# Altium schematic sheet 09_LMS2_RF.SchDoc: LMS7002M RF (LMS2)
size A3; Organization: Lime Microsystems; Address1: Surrey Tech Centre; Address2: Guildford GU2 7YG; Address3: Surrey; Address4: United Kingdom; Revision: v1.1; SheetNumber: 9; SheetTotal: 31
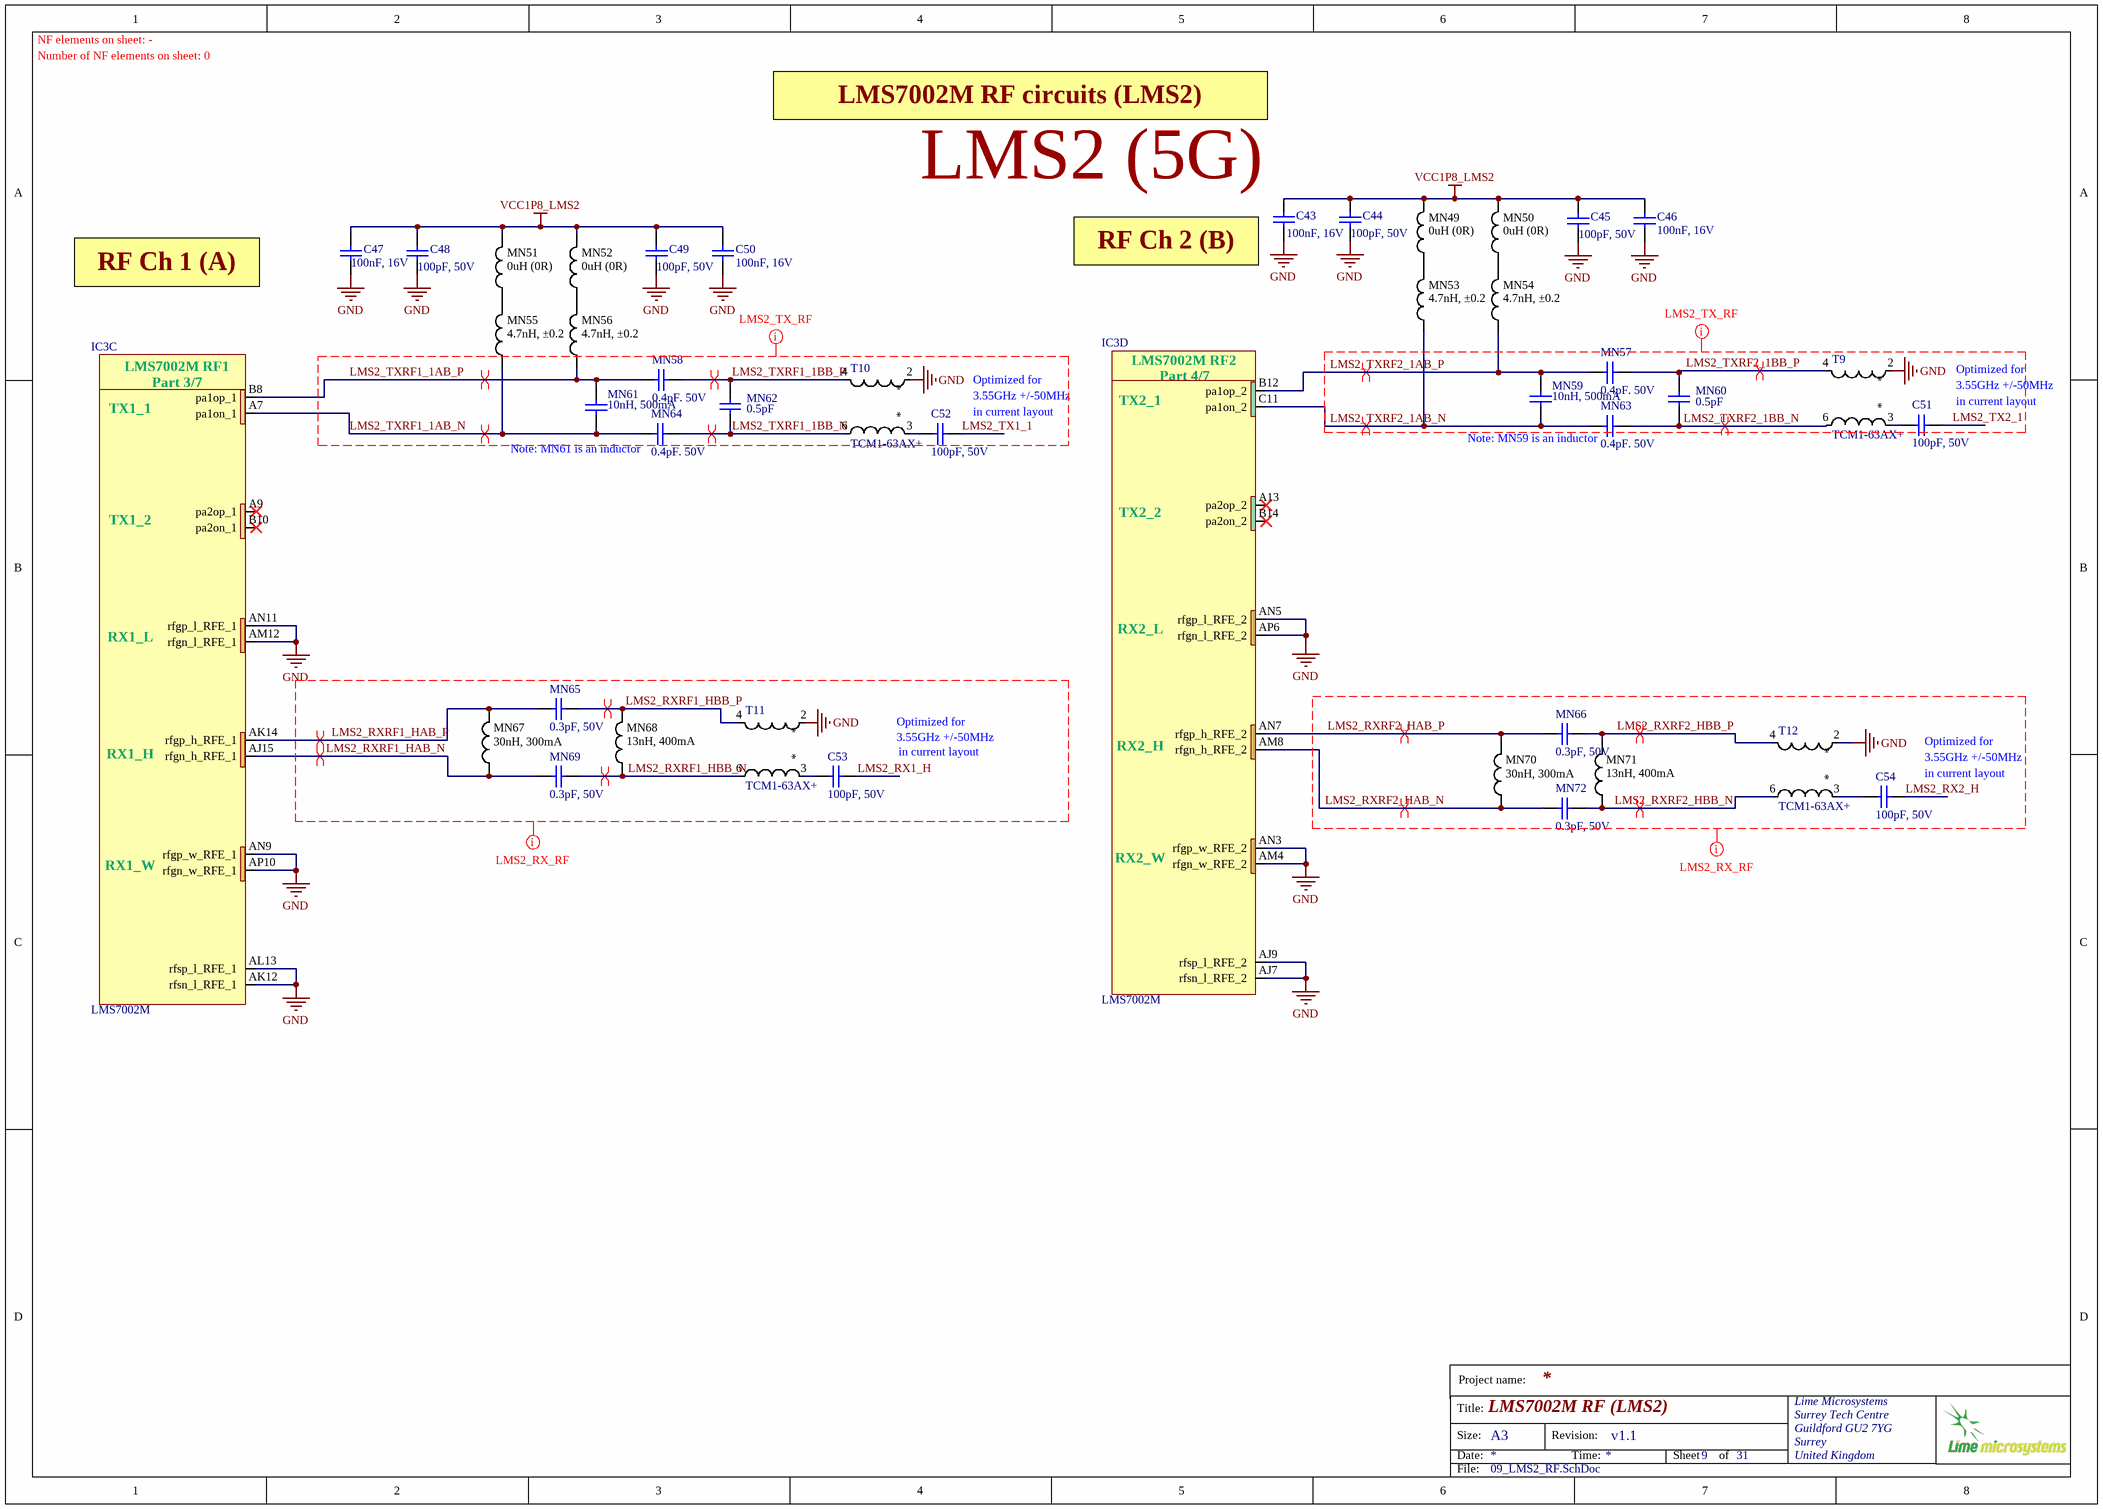
[diagram p0: 09_LMS2_RF.SchDoc]

## Parts
C43  100nF, 16V  [CAP0402]
C44  100pF, 50V  [CAP0402]
C45  100pF, 50V  [CAP0402]
C46  100nF, 16V  [CAP0402]
C47  100nF, 16V  [CAP0402]
C48  100pF, 50V  [CAP0402]
C49  100pF, 50V  [CAP0402]
C50  100nF, 16V  [CAP0402]
C51  100pF, 50V  [CAP0402]
C52  100pF, 50V  [CAP0402]
C53  100pF, 50V  [CAP0402]
C54  100pF, 50V  [CAP0402]
IC3  LMS7002M  [LMS7002M_v5]  (parts C,D of 7)
MN49  0uH (0R)  [RES0603]
MN50  0uH (0R)  [RES0603]
MN51  0uH (0R)  [RES0603]
MN52  0uH (0R)  [RES0603]
MN53  4.7nH, ±0.2  [RES0402]
MN54  4.7nH, ±0.2  [RES0402]
MN55  4.7nH, ±0.2  [RES0402]
MN56  4.7nH, ±0.2  [RES0402]
MN57  0.4pF. 50V  [CAP0402]
MN58  0.4pF. 50V  [CAP0402]
MN59  10nH, 500mA  [CAP0402]
MN60  0.5pF  [CAP0402]
MN61  10nH, 500mA  [CAP0402]
MN62  0.5pF  [CAP0402]
MN63  0.4pF. 50V  [CAP0402]
MN64  0.4pF. 50V  [CAP0402]
MN65  0.3pF, 50V  [CAP0402]
MN66  0.3pF, 50V  [CAP0402]
MN67  30nH, 300mA  [RES0402]
MN68  13nH, 400mA  [RES0402]
MN69  0.3pF, 50V  [CAP0402]
MN70  30nH, 300mA  [RES0402]
MN71  13nH, 400mA  [RES0402]
MN72  0.3pF, 50V  [CAP0402]
T9  TCM1-63AX+  [TCM1-63AX+_v2]
T10  TCM1-63AX+  [TCM1-63AX+_v2]
T11  TCM1-63AX+  [TCM1-63AX+_v2]
T12  TCM1-63AX+  [TCM1-63AX+_v2]

## Nets
GND: C43.1 C44.1 C45.1 C46.1 C47.1 C48.1 C49.1 C50.1 IC3.AJ7(rfsn_l_RFE_2) IC3.AJ9(rfsp_l_RFE_2) IC3.AK12(rfsn_l_RFE_1) IC3.AL13(rfsp_l_RFE_1) IC3.AM4(rfgn_w_RFE_2) IC3.AM12(rfgn_l_RFE_1) IC3.AN3(rfgp_w_RFE_2) IC3.AN5(rfgp_l_RFE_2) IC3.AN9(rfgp_w_RFE_1) IC3.AN11(rfgp_l_RFE_1) IC3.AP6(rfgn_l_RFE_2) IC3.AP10(rfgn_w_RFE_1) T9.2 T10.2 T11.2 T12.2
VCC1P8_LMS2: C43.2 C44.2 C45.2 C46.2 C47.2 C48.2 C49.2 C50.2 MN49.2 MN50.2 MN51.2 MN52.2
LMS2_RX1_H: C53.1
LMS2_RX2_H: C54.1
LMS2_RXRF1_HAB_N: IC3.AJ15(rfgn_h_RFE_1) MN67.1 MN69.2
LMS2_RXRF1_HAB_P: IC3.AK14(rfgp_h_RFE_1) MN65.2 MN67.2
LMS2_RXRF1_HBB_N: MN68.1 MN69.1 T11.6
LMS2_RXRF1_HBB_P: MN65.1 MN68.2 T11.4
LMS2_RXRF2_HAB_N: IC3.AM8(rfgn_h_RFE_2) MN70.1 MN72.2
LMS2_RXRF2_HAB_P: IC3.AN7(rfgp_h_RFE_2) MN66.2 MN70.2
LMS2_RXRF2_HBB_N: MN71.1 MN72.1 T12.6
LMS2_RXRF2_HBB_P: MN66.1 MN71.2 T12.4
LMS2_TX1_1: C52.1
LMS2_TX2_1: C51.1
LMS2_TXRF1_1AB_N: IC3.A7(pa1on_1) MN55.1 MN61.2 MN64.2
LMS2_TXRF1_1AB_P: IC3.B8(pa1op_1) MN56.1 MN58.2 MN61.1
LMS2_TXRF1_1BB_N: MN62.1 MN64.1 T10.6
LMS2_TXRF1_1BB_P: MN58.1 MN62.2 T10.4
LMS2_TXRF2_1AB_N: IC3.C11(pa1on_2) MN53.1 MN59.2 MN63.2
LMS2_TXRF2_1AB_P: IC3.B12(pa1op_2) MN54.1 MN57.2 MN59.1
LMS2_TXRF2_1BB_N: MN60.1 MN63.1 T9.6
LMS2_TXRF2_1BB_P: MN57.1 MN60.2 T9.4
NetC51_2: C51.2 T9.3
NetC52_2: C52.2 T10.3
NetC53_2: C53.2 T11.3
NetC54_2: C54.2 T12.3
NetMN49_1: MN49.1 MN53.2
NetMN50_1: MN50.1 MN54.2
NetMN51_1: MN51.1 MN55.2
NetMN52_1: MN52.1 MN56.2

Not connected (* = marked no-connect by the designer): IC3 A9(pa2op_1)* A13(pa2op_2)* B10(pa2on_1)* B14(pa2on_2)*

## Layout directives
differential pair: LMS2_RXRF1_HAB_N, LMS2_RXRF1_HAB_P, LMS2_RXRF1_HBB_N, LMS2_RXRF1_HBB_P, LMS2_RXRF2_HAB_N, LMS2_RXRF2_HAB_P, LMS2_RXRF2_HBB_N, LMS2_RXRF2_HBB_P, LMS2_TXRF1_1AB_N, LMS2_TXRF1_1AB_P, LMS2_TXRF1_1BB_N, LMS2_TXRF1_1BB_P, LMS2_TXRF2_1AB_N, LMS2_TXRF2_1AB_P, LMS2_TXRF2_1BB_N, LMS2_TXRF2_1BB_P
net class LMS2_RX_RF: GND, LMS2_RX1_H, LMS2_RX2_H, LMS2_RXRF1_HAB_N, LMS2_RXRF1_HAB_P, LMS2_RXRF1_HBB_N, LMS2_RXRF1_HBB_P, LMS2_RXRF2_HAB_N, LMS2_RXRF2_HAB_P, LMS2_RXRF2_HBB_N, LMS2_RXRF2_HBB_P
net class LMS2_TX_RF: GND, LMS2_TX1_1, LMS2_TX2_1, LMS2_TXRF1_1AB_N, LMS2_TXRF1_1AB_P, LMS2_TXRF1_1BB_N, LMS2_TXRF1_1BB_P, LMS2_TXRF2_1AB_N, LMS2_TXRF2_1AB_P, LMS2_TXRF2_1BB_N, LMS2_TXRF2_1BB_P

## Notes on the sheet
- NF elements on sheet: -
- Number of NF elements on sheet: 0
- LMS7002M RF circuits (LMS2)
- (near C43) LMS2 (5G)
- RF Ch 1 (A)
- (near C43) RF Ch 2 (B)
- Optimized for
- (near MN64) Note: MN61 is an inductor
- (near C52) 3.55GHz +/-50MHz
- (near C52) in current layout
- (near MN63) Note: MN59 is an inductor
- (near C51) 3.55GHz +/-50MHz
- (near C51) in current layout
- 3.55GHz +/-50MHz
- in current layout
- (near C54) 3.55GHz +/-50MHz
- (near C54) in current layout
- Project name:
- Title:
- Size:
- Date:
- A3
- Revision:
- Time:
- Sheet
- of
- File:
- (in symbol LMS7002Mr4, part C) LMS7002M RF1; Part 3/7; TX1_1; TX1_2; RX1_L; RX1_H; RX1_W
- (in symbol LMS7002Mr4, part D) LMS7002M RF2; Part 4/7; TX2_1; TX2_2; RX2_L; RX2_H; RX2_W

## Library data of the parts
C43 C46 C47 C50 = Cap_0402: Manufacturer: Murata Electronics; Manufacturer Part Number 1: GRM155R71C104KA88D; Part Description: 0.10µF ±10% 16V X7R Ceramic Capacitor -55°C ~ 125°C Surface Mount, MLCC 0402 (1005 Metric) 0.039" L x 0.020" W (1.00mm x 0.50mm); Tolerance: 10 %; Type: General Purpose MLCC; Capacitance: 0.1 uF; Case Length: 1 mm; Dielectric: X7R; Case Height: 0.5 mm; Temperature Coefficient / Code: +/- 15 %; Value: 100nF, 16V; Supplier 1: Mouser; Supplier Part Number 1: 81-GRM155R71C104KA88; Case Code - in: 0402; RoHS: RoHS Compliant; Operating Temperature Range: - 55 C to + 125 C; Series: GRM; Termination Style: SMD/SMT; Package / Case: 0402 (1005 metric); Voltage Rating DC: 16 V; Maximum Operating Temperature: + 125 C; Case Code - mm: 1005; Minimum Operating Temperature: - 55 C; Product Category: Low & Medium Capacitance SMD Ceramic Chip Capacitors; Packaging: Reel; Product: General Type MLCCs; Category: Multilayer Ceramic Capacitors MLCC - SMD/SMT; Brand: Murata Electronics; Case Width: 0.5 mm; RoHS - Mouser: Y; Standard Pack Qty: 10000; Minimum Order Quantity: 1; Reeling: True
C44 C45 C48 C49 = Cap_0402: Manufacturer Part Number 1: CC0402JRNPO9BN101; Manufacturer: Yageo; Part Description: 100pF ±5% 50V C0G, NP0 Ceramic Capacitor -55°C ~ 125°C Surface Mount, MLCC 0402 (1005 Metric) 0.039" L x 0.020" W (1.00mm x 0.50mm); Temperature Coefficient: C0G, NP0; Tolerance: ±5%; Value: 100pF, 50V; Supplier 1: Digi-Key; Supplier Part Number 1: 311-1024-1-ND; RoHS: RoHS Compliant; Category: Capacitors; Applications: General Purpose; Mounting Type: Surface Mount, MLCC; Capacitance: 100pF; Ratings: -; Packaging: Cut Tape (CT); Voltage - Rated: 50V; Size / Dimension: 0.039" L x 0.020" W (1.00mm x 0.50mm); Height - Seated (Max): -; Package / Case: 0402 (1005 Metric); Operating Temperature: -55°C ~ 125°C; Features: -; Lead Spacing: -; Lead Style: -; Thickness (Max): 0.022" (0.55mm)
C51-C54 = Cap_0402: Manufacturer Part Number 1: CC0402JRNPO9BN101; Manufacturer: Yageo; Part Description: 100pF ±5% 50V C0G, NP0 Ceramic Capacitor -55°C ~ 125°C Surface Mount, MLCC 0402 (1005 Metric) 0.039" L x 0.020" W (1.00mm x 0.50mm); Tolerance: ±5%; Temperature Coefficient: C0G, NP0; Value: 100pF, 50V; Capacitance: 100pF; Thickness (Max): 0.022" (0.55mm); Size / Dimension: 0.039" L x 0.020" W (1.00mm x 0.50mm); RoHS: RoHS Compliant; Ratings: -; Package / Case: 0402 (1005 Metric); Mounting Type: Surface Mount, MLCC; Height - Seated (Max): -; Features: -; Lead Spacing: -; Voltage - Rated: 50V; Operating Temperature: -55°C ~ 125°C; Packaging: Cut Tape (CT); Applications: General Purpose; Lead Style: -; Supplier 1: Digi-Key; Category: Capacitors; Supplier Part Number 1: 311-1024-1-ND
IC3 = LMS7002Mr4: Schematic symbol revision 4. Default footprint - 0.31mm pad; Manufacturer: Lime Microsystems; Part Description: IC FPRF Transceiver LMS7002M; 261 pin aQFN; Supplier 1: Lime Microsystems; Supplier Part Number 1: LMS7002M; Manufacturer Part Number 1: LMS7002M
MN49 MN51 = Inductor_0603: Part Description: 0 Ohms Jumper 0.1W, 1/10W Chip Resistor 0603 (1608 Metric) Automotive AEC-Q200 Thick Film; Manufacturer: Panasonic Electronic Components; Manufacturer Part Number: ERJ-3GEY0R00V; Tolerance: Jumper; Power (Watts): 0.1W, 1/10W; Value: 0uH (0R); Supplier 1: Digi-Key; Supplier Part Number 1: P0.0GCT-ND; RoHS: RoHS Compliant; Category: Resistors; Stock 1: 31663129; Pricing 1: 1=0.1, 10=0.04, 25=0.0292, 50=0.0222, 100=0.0164, 250=0.01252, 500=0.01002, 1000=0.00737 (USD); Packaging: Cut Tape (CT); Part Status: Active; Composition: Thick Film; Features: Automotive AEC-Q200; Temperature Coefficient: -; Operating Temperature: -55°C ~ 155°C; Package / Case: 0603 (1608 Metric); Supplier Device Package: 0603; Size / Dimension: 0.063" L x 0.032" W (1.60mm x 0.80mm); Height - Seated (Max): 0.022" (0.55mm); Failure Rate: -; ComponentLink1URL: http://industrial.panasonic.com/www-cgi/jvcr13pz.cgi?E+PZ+3+AOA0001+ERJ3GEY0R00V+7+WW; ComponentLink1Description: http://industrial.panasonic.com/www-cgi/jvcr13pz.cgi?E+PZ+3+AOA0001+ERJ3GEY0R00V+7+WW; Manufacturer Part Number 1: ERJ-3GEY0R00V
MN50 MN52 = Inductor_0603: Part Description: 0 Ohms Jumper 0.1W, 1/10W Chip Resistor 0603 (1608 Metric) Automotive AEC-Q200 Thick Film; Manufacturer: Panasonic Electronic Components; Manufacturer Part Number: ERJ-3GEY0R00V; Power (Watts): 0.1W, 1/10W; Tolerance: Jumper; Value: 0uH (0R); Category: Resistors; ComponentLink1Description: http://industrial.panasonic.com/www-cgi/jvcr13pz.cgi?E+PZ+3+AOA0001+ERJ3GEY0R00V+7+WW; ComponentLink1URL: http://industrial.panasonic.com/www-cgi/jvcr13pz.cgi?E+PZ+3+AOA0001+ERJ3GEY0R00V+7+WW; Composition: Thick Film; Failure Rate: -; Features: Automotive AEC-Q200; Height - Seated (Max): 0.022" (0.55mm); Operating Temperature: -55°C ~ 155°C; Package / Case: 0603 (1608 Metric); Packaging: Cut Tape (CT); Part Status: Active; Pricing 1: 1=0.1, 10=0.04, 25=0.0292, 50=0.0222, 100=0.0164, 250=0.01252, 500=0.01002, 1000=0.00737 (USD); RoHS: RoHS Compliant; Size / Dimension: 0.063" L x 0.032" W (1.60mm x 0.80mm); Stock 1: 31663129; Supplier 1: Digi-Key; Supplier Device Package: 0603; Supplier Part Number 1: P0.0GCT-ND; Temperature Coefficient: -; Manufacturer Part Number 1: ERJ-3GEY0R00V
MN53-MN56 = Inductor_0603: Manufacturer: Murata; Manufacturer Part Number 1: LQW15AN4N7C00D; Part Description: 4.7nH Unshielded Wirewound Inductor 750mA 70mOhm Max 0402 (1006 Metric); Core Material: Air; Current Rating: 750mA; DC Resistance (DCR): 70mR; Q Factor: 25; Self Resonant Frequency: 8GHz; Shielding: Unshielded; Test Frequency: 100MHz; Case/Package: 0402; Case Code (Imperial): 0402; Case Code (Metric): 1005; DC Current: 750mA; Depth: 0.7mm; Height: 0.5mm; Inductance: 4.7nH; Lead Free: Lead Free; Length: 1mm; Max DC Current: 750mA; Max Operating Temperature: 125°C; Military Standard: Not; Min Operating Temperature: -55°C; Mount: Surface Mount; Number of Pins: 2; Package Quantity: 10000; Packaging: Tape and Reel; Pricing 1: 1=0,18000, 10=0,16300, 100=0,10870, 500=0,09058, 1000=0,07608, 2500=0,06522 (USD); Radiation Hardening: No; REACH SVHC: No SVHC; RoHS: Yes; Stock 1: 48802; Supplier 1: Digi-Key; Supplier Part Number 1: 490-1139-1-ND; Termination: SMD/SMT; Value: 4.7nH, ±0.2; Weight: 2.8E-05oz; Width: 0.02inch
MN57 MN58 MN63 MN64 = Cap_0402: Part Description: 0.4 pF ±0.05pF 50V Ceramic Capacitor C0G, NP0 0402 (1005 Metric); Manufacturer: Murata; Manufacturer Part Number 1: GJM1555C1HR40WB01D; Capacitance: 0.4pF; Dielectric: C0G; Value: 0.4pF. 50V; Supplier 1: Arrow Electronics; Supplier Part Number 1: GJM1555C1HR40WB01D; Stock 1: 12385; Pricing 1: 1=0,20210, 10=0,14340, 25=0,12680, 100=0,08350, 250=0,08280, 500=0,07340, 1000=0,07270, 3000=0,07200, 6000=0,04460 (USD); RoHS: Yes; Mount: Surface Mount; Case/Package: 0402; Case Code (Metric): 1005; Case Code (Imperial): 0402; Min Operating Temperature: -55°C; Max Operating Temperature: 125°C; Packaging: Tape and Reel; Package Quantity: 10000; Voltage Rating: 50V; Voltage Rating (DC): 50V; Termination: SMD/SMT; Series: GJM; Construction: Flat; Length: 1mm; Width: 0.02inch; Height: 0.5mm; Thickness: 0.022inch; Depth: 0.5mm; Radiation Hardening: No; Lead Free: Lead Free; RoHS Compliant: Yes; ComponentLink1URL: https://datasheet.ciiva.com/11621/product-11621841.pdf?src-supplier=Avnet; ComponentLink1Description: https://datasheet.ciiva.com/11621/product-11621841.pdf?src-supplier=Avnet; ComponentLink2URL: https://datasheet.ciiva.com/169/partnumbering-e-01-169682.pdf?src-supplier=Digi-Key; ComponentLink2Description: https://datasheet.ciiva.com/169/partnumbering-e-01-169682.pdf?src-supplier=Digi-Key
MN59 MN61 = Cap_0402: Part Description: 10 nH Unshielded Wirewound Inductor 500 mA 170mOhm Max 0402 (1005 Metric); Manufacturer: Murata; Manufacturer Part Number 1: LQW15AN10NG00D; Core Material: Non-Magnetic,Air,Ferrite; Tolerance: 2%; Shielding: Unshielded; DC Resistance (DCR): 170mR; Self Resonant Frequency: 5.5GHz; Test Frequency: 100MHz; Current: 370mA; Value: 10nH, 500mA; Supplier 1: Arrow Electronics; Supplier Part Number 1: LQW15AN10NG00D; Stock 1: 20000; Pricing 1: 10000=0,07910, 20000=0,05460 (USD); RoHS: Yes; Mount: Surface Mount; Case/Package: 0402; Number of Pins: 2; Weight: 2.8E-05oz; Case Code (Metric): 1005; Case Code (Imperial): 0402; Min Operating Temperature: -55°C; Max Operating Temperature: 125°C; Inductance Tolerance: 2%; Packaging: Tape and Reel; Package Quantity: 10000; Current Rating: 500mA; Resistor Type: Wirewound; Inductance: 10nH; Max DC Current: 500mA; Termination: SMD/SMT; DC Current: 500mA; Length: 1mm; Width: 0.02inch; Height: 0.5mm; Height - Seated (Max): 0.024inch; Depth: 0.7mm; Radiation Hardening: No; REACH SVHC: No SVHC; Military Standard: Not; Lead Free: Lead Free; RoHS Compliant: Yes; ComponentLink1URL: https://datasheet.ciiva.com/11799/0900766b8090d800-11799107.pdf?src-supplier=RSComponents; ComponentLink1Description: https://datasheet.ciiva.com/11799/0900766b8090d800-11799107.pdf?src-supplier=RSComponents; ComponentLink2URL: https://datasheet.ciiva.com/6705/l0075s0080lqw15a-00-6705338.pdf?src-supplier=Digi-Key; ComponentLink2Description: https://datasheet.ciiva.com/6705/l0075s0080lqw15a-00-6705338.pdf?src-supplier=Digi-Key; ComponentLink3URL: https://datasheet.ciiva.com/6705/l0075s0080lqw15a-00-6705337.pdf?src-supplier=Digi-Key; ComponentLink3Description: https://datasheet.ciiva.com/6705/l0075s0080lqw15a-00-6705337.pdf?src-supplier=Digi-Key; ComponentLink4URL: https://datasheet.ciiva.com/6705/l0075s0080lqw15a-00-6705339.pdf?src-supplier=Digi-Key; ComponentLink4Description: https://datasheet.ciiva.com/6705/l0075s0080lqw15a-00-6705339.pdf?src-supplier=Digi-Key; ComponentLink5URL: https://datasheet.ciiva.com/4977/product-4977514.pdf?src-supplier=Mouser; ComponentLink5Description: https://datasheet.ciiva.com/4977/product-4977514.pdf?src-supplier=Mouser; ComponentLink6URL: https://datasheet.ciiva.com/8508/l0075s0080lqw15a-00-8508734.pdf?src-supplier=Avnet; ComponentLink6Description: https://datasheet.ciiva.com/8508/l0075s0080lqw15a-00-8508734.pdf?src-supplier=Avnet; ComponentLink7URL: https://datasheet.ciiva.com/25644/l0075s0080lqw15a-00-25644999.pdf?src-supplier=Future+Electronics; ComponentLink7Description: https://datasheet.ciiva.com/25644/l0075s0080lqw15a-00-25644999.pdf?src-supplier=Future+Electronics
MN60 MN62 = Cap_0402: Manufacturer: Yageo; Manufacturer Part Number 1: CC0402CRNPO9BNR50; Part Description: 0.50pF ±0.25pF 50V C0G, NP0 Ceramic Capacitor -55°C ~ 125°C Surface Mount, MLCC 0402 (1005 Metric) 0.039" L x 0.020" W (1.00mm x 0.50mm); Capacitance: 0.50pF; Voltage - Rated: 50V; Temperature Coefficient: C0G, NP0; Tolerance: ±0.25pF; Value: 0.5pF; Supplier 1: Digi-Key; Supplier Part Number 1: 311-1001-1-ND; RoHS: RoHS Compliant; Thickness (Max): 0.022" (0.55mm); Features: -; Height - Seated (Max): -; Lead Spacing: -; Applications: General Purpose; Packaging: Cut Tape (CT); Ratings: -; Size / Dimension: 0.039" L x 0.020" W (1.00mm x 0.50mm); Lead Style: -; Mounting Type: Surface Mount, MLCC; Operating Temperature: -55°C ~ 125°C; Package / Case: 0402 (1005 Metric); Category: Capacitors
MN65 MN66 MN69 MN72 = Cap_0402: Part Description: 0.3 pF ±0.1pF 50V Ceramic Capacitor C0G, NP0 0402 (1005 Metric); Manufacturer: Johanson; Manufacturer Part Number 1: QSCF500Q0R3B1GV001T; Value: 0.3pF, 50V; ComponentLink1URL: https://datasheet.ciiva.com/11617/product-11617574.pdf?src-supplier=Avnet; ComponentLink1Description: https://datasheet.ciiva.com/11617/product-11617574.pdf?src-supplier=Avnet; ComponentLink2URL: https://datasheet.ciiva.com/169/partnumbering-e-01-169995.pdf?src-supplier=Digi-Key; ComponentLink2Description: https://datasheet.ciiva.com/169/partnumbering-e-01-169995.pdf?src-supplier=Digi-Key; ComponentLink3URL: https://datasheet.ciiva.com/6263/grm1555c1hr10wa01-01-6263952.pdf?src-supplier=Digi-Key; ComponentLink3Description: https://datasheet.ciiva.com/6263/grm1555c1hr10wa01-01-6263952.pdf?src-supplier=Digi-Key; ComponentLink4URL: https://datasheet.ciiva.com/6263/partnumbering-e-01-6263949.pdf?src-supplier=Digi-Key; ComponentLink4Description: https://datasheet.ciiva.com/6263/partnumbering-e-01-6263949.pdf?src-supplier=Digi-Key; ComponentLink5URL: https://datasheet.ciiva.com/6263/partnumbering-e-01-6263947.pdf?src-supplier=Digi-Key; ComponentLink5Description: https://datasheet.ciiva.com/6263/partnumbering-e-01-6263947.pdf?src-supplier=Digi-Key; ComponentLink6URL: https://datasheet.ciiva.com/5414/product-5414742.pdf?src-supplier=Mouser; ComponentLink6Description: https://datasheet.ciiva.com/5414/product-5414742.pdf?src-supplier=Mouser; ComponentLink7URL: https://datasheet.ciiva.com/11618/product-11618981.pdf?src-supplier=Avnet; ComponentLink7Description: https://datasheet.ciiva.com/11618/product-11618981.pdf?src-supplier=Avnet; Supplier 1: DigiKey; Supplier Part Number 1: 712-QSCF500Q0R3B1GV001TCT-ND; Stock 1: 139276; Pricing 1: 1=0,13, 10=0,093, 50=0,053, 100=0,0439, 500=0,0308, 1000=0,0255, 2500=0,02374, 5000=0,02172 (USD); RoHS: Yes; RoHS Compliant: Yes
MN67 MN70 = Inductor_0603: Part Description: 30 nH Unshielded Multilayer Inductor 300 mA 800mOhm Max 0402 (1005 Metric); Manufacturer: TDK; Manufacturer Part Number 1: MLG1005S30NJT000; Core Material: Non-Magnetic; Tolerance: 5%; Shielding: Unshielded; DC Resistance (DCR): 800mR; Self Resonant Frequency: 1.5GHz; Test Frequency: 100MHz; Value: 30nH, 300mA; ComponentLink1URL: https://datasheet.ciiva.com/11801/0900766b8090d800-11801389.pdf?src-supplier=RSComponents; ComponentLink1Description: https://datasheet.ciiva.com/11801/0900766b8090d800-11801389.pdf?src-supplier=RSComponents; ComponentLink2URL: https://datasheet.ciiva.com/17278/l0075s0080lqw15a-00-17278445.pdf?src-supplier=Avnet+Europe; ComponentLink2Description: https://datasheet.ciiva.com/17278/l0075s0080lqw15a-00-17278445.pdf?src-supplier=Avnet+Europe; ComponentLink3URL: https://datasheet.ciiva.com/16455/l0075s0080lqw15a-00-16455931.pdf?src-supplier=Future+Electronics; ComponentLink3Description: https://datasheet.ciiva.com/16455/l0075s0080lqw15a-00-16455931.pdf?src-supplier=Future+Electronics; ComponentLink4URL: https://datasheet.ciiva.com/11799/0900766b8090d800-11799107.pdf?src-supplier=RSComponents; ComponentLink4Description: https://datasheet.ciiva.com/11799/0900766b8090d800-11799107.pdf?src-supplier=RSComponents; ComponentLink5URL: https://datasheet.ciiva.com/6705/l0075s0080lqw15a-00-6705338.pdf?src-supplier=Digi-Key; ComponentLink5Description: https://datasheet.ciiva.com/6705/l0075s0080lqw15a-00-6705338.pdf?src-supplier=Digi-Key; ComponentLink6URL: https://datasheet.ciiva.com/6705/l0075s0080lqw15a-00-6705337.pdf?src-supplier=Digi-Key; ComponentLink6Description: https://datasheet.ciiva.com/6705/l0075s0080lqw15a-00-6705337.pdf?src-supplier=Digi-Key; ComponentLink7URL: https://datasheet.ciiva.com/6705/l0075s0080lqw15a-00-6705339.pdf?src-supplier=Digi-Key; ComponentLink7Description: https://datasheet.ciiva.com/6705/l0075s0080lqw15a-00-6705339.pdf?src-supplier=Digi-Key; ComponentLink8URL: https://datasheet.ciiva.com/4977/product-4977514.pdf?src-supplier=Mouser; ComponentLink8Description: https://datasheet.ciiva.com/4977/product-4977514.pdf?src-supplier=Mouser; ComponentLink9URL: https://datasheet.ciiva.com/8508/l0075s0080lqw15a-00-8508734.pdf?src-supplier=Avnet; ComponentLink9Description: https://datasheet.ciiva.com/8508/l0075s0080lqw15a-00-8508734.pdf?src-supplier=Avnet; ComponentLink10URL: https://datasheet.ciiva.com/25644/l0075s0080lqw15a-00-25644999.pdf?src-supplier=Future+Electronics; ComponentLink10Description: https://datasheet.ciiva.com/25644/l0075s0080lqw15a-00-25644999.pdf?src-supplier=Future+Electronics; Supplier 1: Digi-Key; Supplier Part Number 1: 445-6312-1-ND; Stock 1: 41662; Pricing 1: 1=0,13, 10=0,115, 25=0,1024, 50=0,0868, 100=0,0767, 250=0,07028, 500=0,06388, 1000=0,05366, 2500=0,046 (USD); RoHS: Yes; Mount: Surface Mount; Case/Package: 0402; Case Code (Metric): 1005; Case Code (Imperial): 0402; Min Operating Temperature: -55°C; Max Operating Temperature: 125°C; Current Rating: 300mA; Package Quantity: 10000; Packaging: Cut Tape; Inductance: 30nH; Series: MLG; Length: 0.039inch; Width: 0.02inch; Height - Seated (Max): 0.022inch; RoHS Compliant: Yes; ComponentLink11URL: https://datasheet.ciiva.com/29696/inductor-commercial-high-frequency-mlg-en-29696712.pdf?src-supplier=Digi-Key; ComponentLink11Description: https://datasheet.ciiva.com/29696/inductor-commercial-high-frequency-mlg-en-29696712.pdf?src-supplier=Digi-Key; ComponentLink12URL: https://datasheet.ciiva.com/29696/inductor-commercial-high-frequency-mlg-en-29696711.pdf?src-supplier=Digi-Key; ComponentLink12Description: https://datasheet.ciiva.com/29696/inductor-commercial-high-frequency-mlg-en-29696711.pdf?src-supplier=Digi-Key; ComponentLink13URL: https://datasheet.ciiva.com/29696/inductor-commercial-high-frequency-mlg-en-29696710.pdf?src-supplier=Digi-Key; ComponentLink13Description: https://datasheet.ciiva.com/29696/inductor-commercial-high-frequency-mlg-en-29696710.pdf?src-supplier=Digi-Key
MN68 MN71 = Inductor_0603: Part Description: 13 nH Unshielded Multilayer Inductor 400 mA 500mOhm Max 0402 (1005 Metric); Manufacturer: TDK; Manufacturer Part Number 1: MLG1005S13NJT000; Core Material: Non-Magnetic,Ceramic; Tolerance: 5%; Shielding: Unshielded; DC Resistance (DCR): 500mR; Self Resonant Frequency: 2.4GHz; Test Frequency: 100MHz; Value: 13nH, 400mA; ComponentLink1URL: https://datasheet.ciiva.com/11801/0900766b8090d800-11801389.pdf?src-supplier=RSComponents; ComponentLink1Description: https://datasheet.ciiva.com/11801/0900766b8090d800-11801389.pdf?src-supplier=RSComponents; ComponentLink2URL: https://datasheet.ciiva.com/17278/l0075s0080lqw15a-00-17278445.pdf?src-supplier=Avnet+Europe; ComponentLink2Description: https://datasheet.ciiva.com/17278/l0075s0080lqw15a-00-17278445.pdf?src-supplier=Avnet+Europe; ComponentLink3URL: https://datasheet.ciiva.com/16455/l0075s0080lqw15a-00-16455931.pdf?src-supplier=Future+Electronics; ComponentLink3Description: https://datasheet.ciiva.com/16455/l0075s0080lqw15a-00-16455931.pdf?src-supplier=Future+Electronics; ComponentLink4URL: https://datasheet.ciiva.com/11799/0900766b8090d800-11799519.pdf?src-supplier=RSComponents; ComponentLink4Description: https://datasheet.ciiva.com/11799/0900766b8090d800-11799519.pdf?src-supplier=RSComponents; ComponentLink5URL: https://datasheet.ciiva.com/6705/l0075s0080lqw15a-00-6705352.pdf?src-supplier=Digi-Key; ComponentLink5Description: https://datasheet.ciiva.com/6705/l0075s0080lqw15a-00-6705352.pdf?src-supplier=Digi-Key; ComponentLink6URL: https://datasheet.ciiva.com/4978/product-4978090.pdf?src-supplier=Mouser; ComponentLink6Description: https://datasheet.ciiva.com/4978/product-4978090.pdf?src-supplier=Mouser; ComponentLink7URL: https://datasheet.ciiva.com/17277/l0075s0080lqw15a-00-17277850.pdf?src-supplier=Avnet+Europe; ComponentLink7Description: https://datasheet.ciiva.com/17277/l0075s0080lqw15a-00-17277850.pdf?src-supplier=Avnet+Europe; ComponentLink8URL: https://datasheet.ciiva.com/6705/l0075s0080lqw15a-00-6705355.pdf?src-supplier=Digi-Key; ComponentLink8Description: https://datasheet.ciiva.com/6705/l0075s0080lqw15a-00-6705355.pdf?src-supplier=Digi-Key; ComponentLink9URL: https://datasheet.ciiva.com/6705/l0075s0080lqw15a-00-6705357.pdf?src-supplier=Digi-Key; ComponentLink9Description: https://datasheet.ciiva.com/6705/l0075s0080lqw15a-00-6705357.pdf?src-supplier=Digi-Key; ComponentLink10URL: https://datasheet.ciiva.com/11799/0900766b8090d5c4-11799120.pdf?src-supplier=RSComponents; ComponentLink10Description: https://datasheet.ciiva.com/11799/0900766b8090d5c4-11799120.pdf?src-supplier=RSComponents; ComponentLink11URL: https://datasheet.ciiva.com/6705/l0075s0080lqw15a-10-6705512.pdf?src-supplier=Digi-Key; ComponentLink11Description: https://datasheet.ciiva.com/6705/l0075s0080lqw15a-10-6705512.pdf?src-supplier=Digi-Key; ComponentLink12URL: https://datasheet.ciiva.com/6705/l0075s0080lqw15a-10-6705511.pdf?src-supplier=Digi-Key; ComponentLink12Description: https://datasheet.ciiva.com/6705/l0075s0080lqw15a-10-6705511.pdf?src-supplier=Digi-Key; ComponentLink13URL: https://datasheet.ciiva.com/6705/l0075s0080lqw15a-10-6705513.pdf?src-supplier=Digi-Key; ComponentLink13Description: https://datasheet.ciiva.com/6705/l0075s0080lqw15a-10-6705513.pdf?src-supplier=Digi-Key; ComponentLink14URL: https://datasheet.ciiva.com/4976/product-4976988.pdf?src-supplier=Mouser; ComponentLink14Description: https://datasheet.ciiva.com/4976/product-4976988.pdf?src-supplier=Mouser; ComponentLink15URL: https://datasheet.ciiva.com/8506/l0075s0080lqw15a-10-8506007.pdf?src-supplier=Avnet; ComponentLink15Description: https://datasheet.ciiva.com/8506/l0075s0080lqw15a-10-8506007.pdf?src-supplier=Avnet; ComponentLink16URL: https://datasheet.ciiva.com/16455/l0075s0080lqw15a-10-16455870.pdf?src-supplier=Future+Electronics; ComponentLink16Description: https://datasheet.ciiva.com/16455/l0075s0080lqw15a-10-16455870.pdf?src-supplier=Future+Electronics; Supplier 1: Digi-Key; Supplier Part Number 1: 445-6308-1-ND; Stock 1: 21172; Pricing 1: 1=0,13, 10=0,115, 25=0,1024, 50=0,0868, 100=0,0767, 250=0,07028, 500=0,06388, 1000=0,05366, 2500=0,046 (USD); RoHS: Yes; Mount: Surface Mount; Case/Package: 0402; Case Code (Metric): 1005; Case Code (Imperial): 0402; Min Operating Temperature: -55°C; Max Operating Temperature: 125°C; Package Quantity: 1; Packaging: Cut Tape; Current Rating: 400mA; Inductance: 13nH; Series: MLG; Length: 0.039inch; Width: 0.02inch; Height - Seated (Max): 0.022inch; RoHS Compliant: Yes; ComponentLink17URL: https://datasheet.ciiva.com/29699/inductor-commercial-high-frequency-mlg-en-29699007.pdf?src-supplier=Digi-Key; ComponentLink17Description: https://datasheet.ciiva.com/29699/inductor-commercial-high-frequency-mlg-en-29699007.pdf?src-supplier=Digi-Key; ComponentLink18URL: https://datasheet.ciiva.com/29699/inductor-commercial-high-frequency-mlg-en-29699006.pdf?src-supplier=Digi-Key; ComponentLink18Description: https://datasheet.ciiva.com/29699/inductor-commercial-high-frequency-mlg-en-29699006.pdf?src-supplier=Digi-Key
T9-T12 = Balun_v2: Manufacturer: Mini-circuits; Part Description: BALUN WIDE BAND; Manufacturer Part Number 1: TCM1-63AX+; Supplier 1: Mini-circuits; Supplier Part Number 1: TCM1-63AX+